# Altium schematic sheet DevKitWRM1470-r1.2.SchDoc
size A3; SheetNumber: 1; PageSetup: Record=PageOptions|CenterHorizontal=True|CenterVertical=True|PrintScale=0.52|XCorrection=1.00|YCorrection=1.00|PrintKind=1|BorderSize=5000000|LeftOffset=0|BottomOffset=0|Orientation=2|PaperLength=1000|PaperWidth=1000|Scale=100|PaperSource=7|PrintQuality=600|MediaType=1|DitherType=10|PaperKind=A4|PrintScaleMode=1
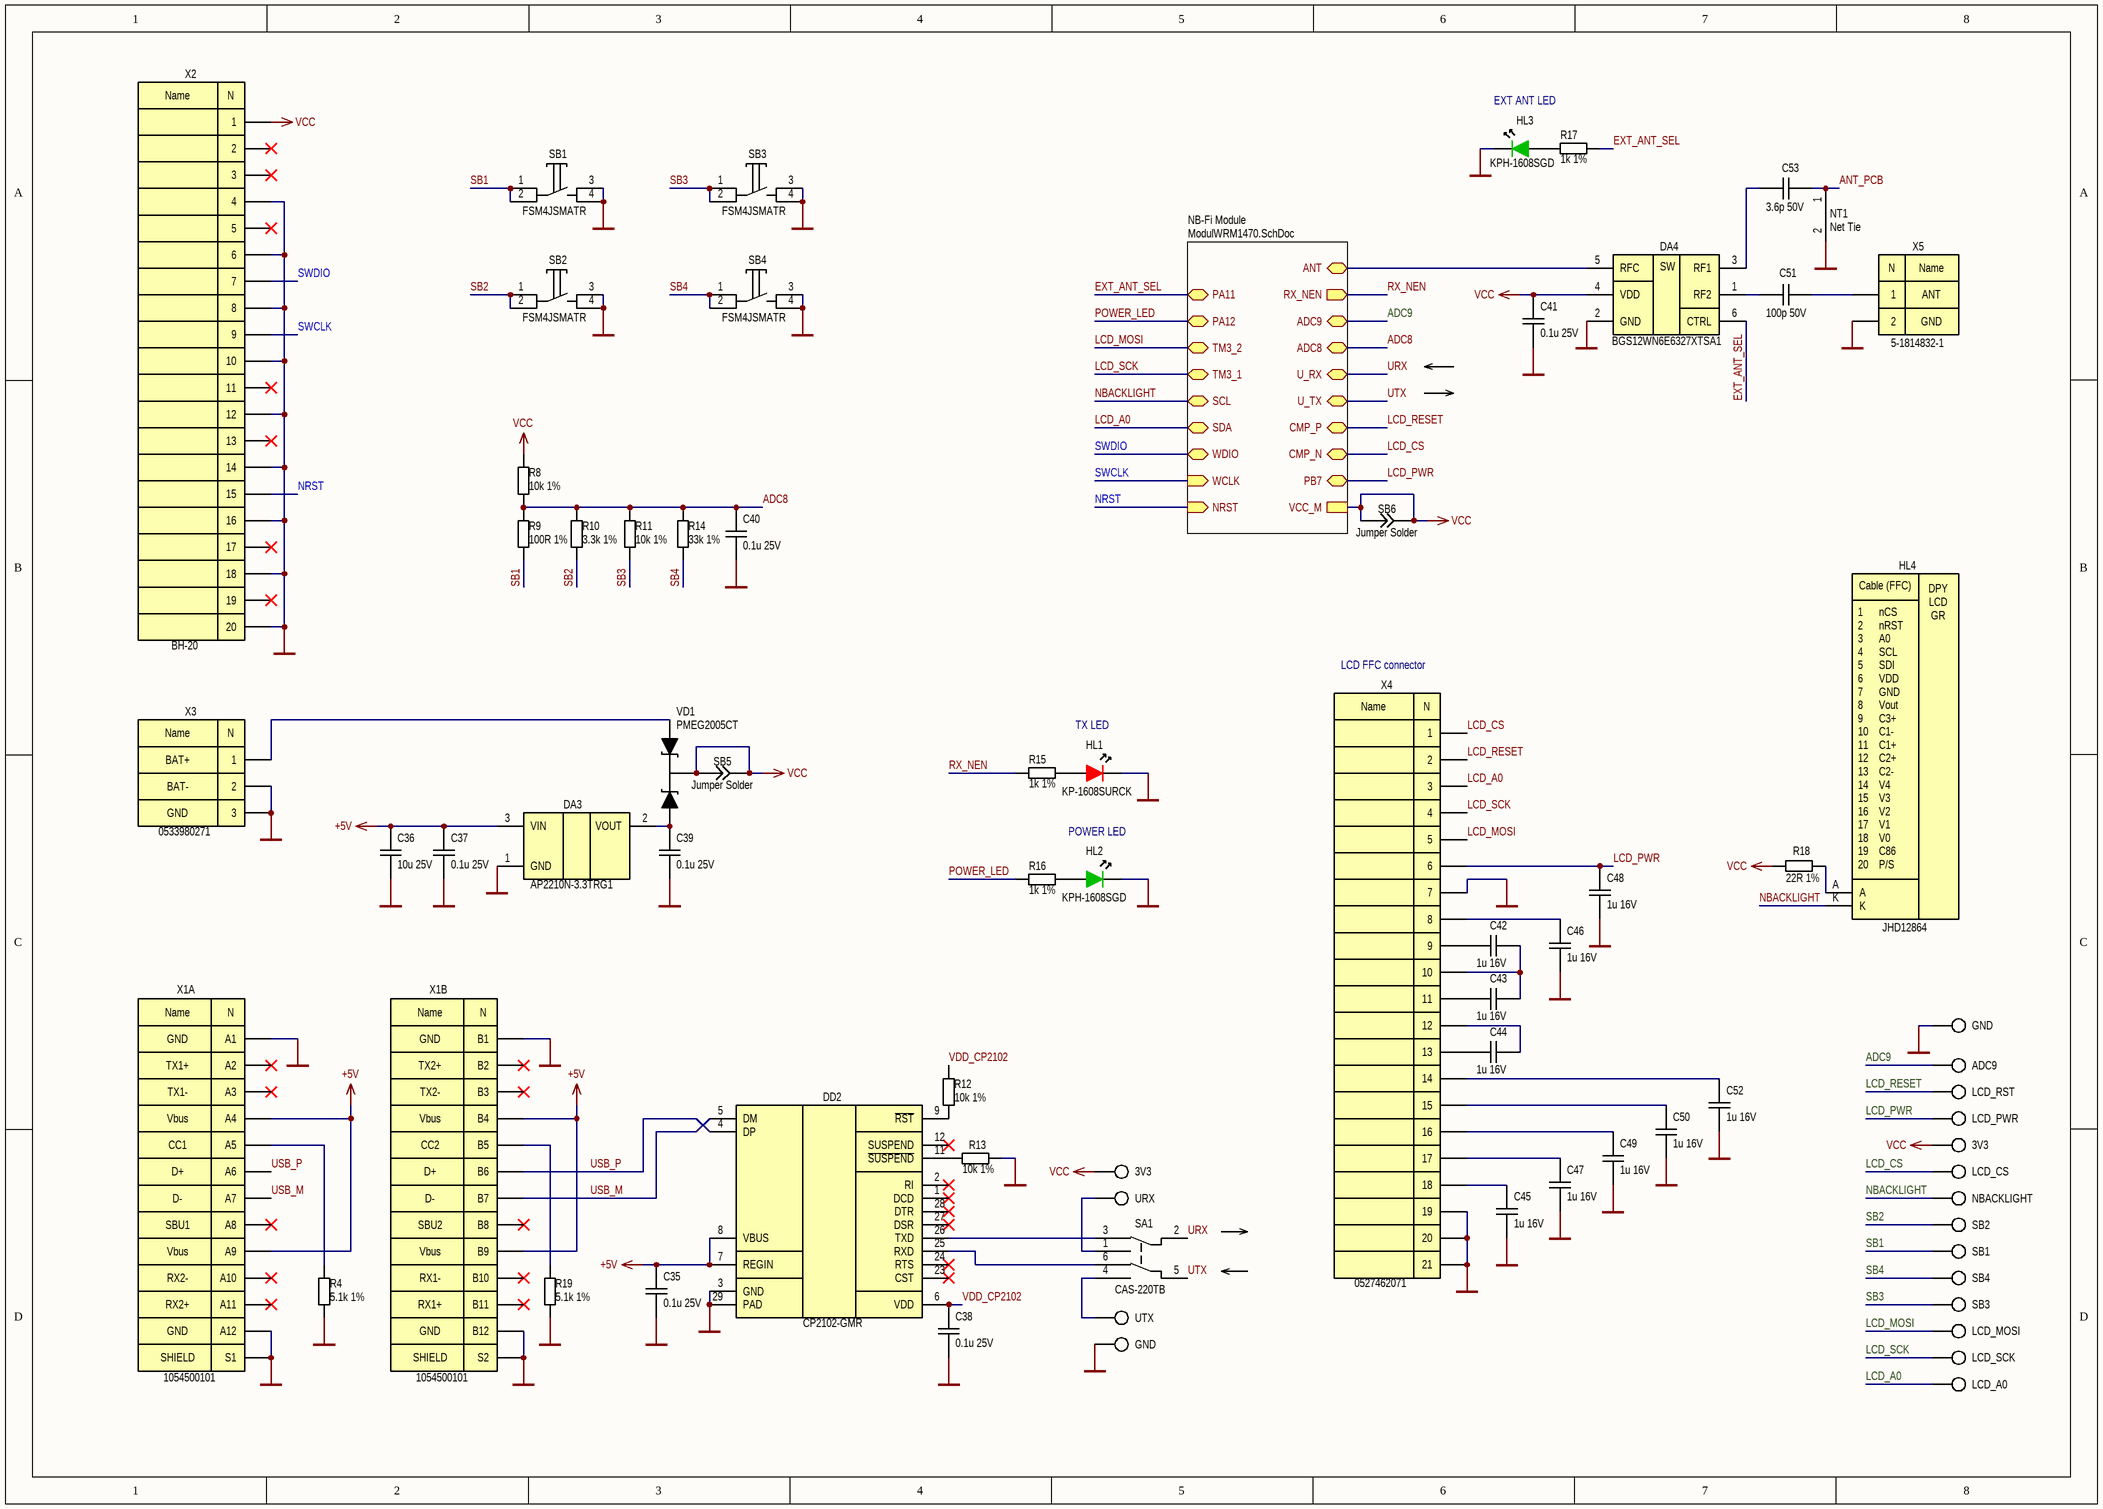
[diagram p0: DevKitWRM1470-r1.2.SchDoc]

## Parts
C35  0.1u 25V  [C0402]
C36  10u 25V  [C0805]
C37  0.1u 25V  [C0402]
C38  0.1u 25V  [C0402]
C39  0.1u 25V  [C0402]
C40  0.1u 25V  [C0402]
C41  0.1u 25V  [C0402]
C42  1u 16V  [C0402]
C43  1u 16V  [C0402]
C44  1u 16V  [C0402]
C45  1u 16V  [C0402]
C46  1u 16V  [C0402]
C47  1u 16V  [C0402]
C48  1u 16V  [C0402]
C49  1u 16V  [C0402]
C50  1u 16V  [C0402]
C51  100p 50V  [C0402]
C52  1u 16V  [C0402]
C53  3.6p 50V  [C0402]
DA3  AP2210N-3.3TRG1  [SOT23-3L]
DA4  BGS12WN6E6327XTSA1  [6-XFDFN]
DD2  CP2102-GMR  [QFN28]
HL1  KP-1608SURCK  [LED0603_RED]
HL2  KPH-1608SGD  [LED0603_GREEN]
HL3  KPH-1608SGD  [LED0603_GREEN]
HL4  JHD12864  [JHD12864]
NT1  Net Tie  [NETTIE-5.0x4.0]  (net tie, no BOM)
R4  5.1k 1%  [R0402]
R8  10k 1%  [R0402]
R9  100R 1%  [R0402]
R10  3.3k 1%  [R0402]
R11  10k 1%  [R0402]
R12  10k 1%  [R0402]
R13  10k 1%  [R0402]
R14  33k 1%  [R0402]
R15  1k 1%  [R0402]
R16  1k 1%  [R0402]
R17  1k 1%  [R0402]
R18  22R 1%  [R0402]
R19  5.1k 1%  [R0402]
SA1  CAS-220TB  [CAS-220]
SB1  FSM4JSMATR  [FSM4JSMATR]
SB2  FSM4JSMATR  [FSM4JSMATR]
SB3  FSM4JSMATR  [FSM4JSMATR]
SB4  FSM4JSMATR  [FSM4JSMATR]
SB5  Jumper Solder  [SB0805]  (no BOM)
SB6  Jumper Solder  [SB0805]  (no BOM)
VD1  PMEG2005CT  [SOT23-3L]
X1  1054500101  [1054500101]  (parts A,B of 2)
X2  BH-20  [BH-20_PCB]
X3  0533980271  [0533980271_PCB]
X4  0527462071  [0527462071_PCB]
X5  5-1814832-1  [5-1814832-1]
XT24  3V3  [PAD-d0.9-x1.5-y1.5]  (no BOM)
XT25  URX  [PAD-d0.9-x1.5-y1.5]  (no BOM)
XT26  UTX  [PAD-d0.9-x1.5-y1.5]  (no BOM)
XT27  GND  [PAD-d0.9-x1.5-y1.5]  (no BOM)
XT28  GND  [PAD-d0.9-x1.5-y1.5]  (no BOM)
XT29  ADC9  [PAD-d0.9-x1.5-y1.5]  (no BOM)
XT30  LCD_RST  [PAD-d0.9-x1.5-y1.5]  (no BOM)
XT31  LCD_PWR  [PAD-d0.9-x1.5-y1.5]  (no BOM)
XT32  3V3  [PAD-d0.9-x1.5-y1.5]  (no BOM)
XT33  LCD_CS  [PAD-d0.9-x1.5-y1.5]  (no BOM)
XT34  NBACKLIGHT  [PAD-d0.9-x1.5-y1.5]  (no BOM)
XT35  SB2  [PAD-d0.9-x1.5-y1.5]  (no BOM)
XT36  SB1  [PAD-d0.9-x1.5-y1.5]  (no BOM)
XT37  SB4  [PAD-d0.9-x1.5-y1.5]  (no BOM)
XT38  SB3  [PAD-d0.9-x1.5-y1.5]  (no BOM)
XT39  LCD_MOSI  [PAD-d0.9-x1.5-y1.5]  (no BOM)
XT40  LCD_SCK  [PAD-d0.9-x1.5-y1.5]  (no BOM)
XT41  LCD_A0  [PAD-d0.9-x1.5-y1.5]  (no BOM)

## Sub-sheets
NB-Fi Module = ModulWRM1470.SchDoc: ADC8 (bidir), TM3_2 (bidir), ADC9 (bidir), TM3_1 (bidir), SCL (bidir), SDA (bidir), WDIO (bidir), WCLK (in), NRST (in), U_RX (bidir), U_TX (bidir), CMP_P (bidir), CMP_N (bidir), ANT (bidir), PA12 (bidir), PB7 (bidir), VCC_M, PA11 (bidir), RX_NEN (out)

## Nets
+5V: C35.2 C36.1 C37.2 DA3.3(VIN) DD2.7(REGIN) DD2.8(VBUS) X1.A4 X1.A9 X1.B4 X1.B9
GND: C35.1 C36.2 C37.1 C38.1 C39.1 C40.1 C41.1 C45.1 C46.1 C47.1 C48.1 C49.1 C50.1 C52.1 DA3.1(GND) DA4.2(GND) DD2.3(GND) DD2.29(PAD) HL1.2 HL2.2 HL3.2 NT1.2 R4.2 R13.1 R19.2 SB1.3 SB1.4 SB2.3 SB2.4 SB3.3 SB3.4 SB4.3 SB4.4 X1.A1 X1.A12 X1.B1 X1.B12 X1.S1 X1.S2 X2.4 X2.6 X2.8 X2.10 X2.12 X2.14 X2.16 X2.18 X2.20 X3.2 X3.3 X4.7 X4.19 X4.20 X4.21 X5.2 XT27.1 XT28.1
VCC: C41.2 DA4.4(VDD) R8.2 R18.2 SB5.1 SB5.2 SB6.1 SB6.2 VD1.3(K) X2.1 XT24.1 XT32.1 ; sheet NB-Fi Module/VCC_M
ADC8: C40.2 R8.1 R9.2 R10.2 R11.2 R14.2 ; sheet NB-Fi Module/ADC8
ADC9: XT29.1 ; sheet NB-Fi Module/ADC9
ANT_PCB: C53.2 NT1.1
EXT_ANT_SEL: DA4.6(CTRL) R17.1 ; sheet NB-Fi Module/PA11
LCD_A0: X4.3 XT41.1 ; sheet NB-Fi Module/SDA
LCD_CS: X4.1 XT33.1 ; sheet NB-Fi Module/CMP_N
LCD_MOSI: X4.5 XT39.1 ; sheet NB-Fi Module/TM3_2
LCD_PWR: C48.2 X4.6 XT31.1 ; sheet NB-Fi Module/PB7
LCD_RESET: X4.2 XT30.1 ; sheet NB-Fi Module/CMP_P
LCD_SCK: X4.4 XT40.1 ; sheet NB-Fi Module/TM3_1
NBACKLIGHT: HL4.K XT34.1 ; sheet NB-Fi Module/SCL
NRST: X2.15 ; sheet NB-Fi Module/NRST
POWER_LED: R16.1 ; sheet NB-Fi Module/PA12
RX_NEN: R15.1 ; sheet NB-Fi Module/RX_NEN
SB1: R9.1 SB1.1 SB1.2 XT36.1
SB2: R10.1 SB2.1 SB2.2 XT35.1
SB3: R11.1 SB3.1 SB3.2 XT38.1
SB4: R14.1 SB4.1 SB4.2 XT37.1
SWCLK: X2.9 ; sheet NB-Fi Module/WCLK
SWDIO: X2.7 ; sheet NB-Fi Module/WDIO
URX: SA1.2 ; sheet NB-Fi Module/U_RX
USB_M: DD2.5(DM) X1.A7 X1.B7
USB_P: DD2.4(DP) X1.A6 X1.B6
UTX: SA1.5 ; sheet NB-Fi Module/U_TX
VDD_CP2102: C38.2 DD2.6(VDD) R12.2
NetC39_2: C39.2 DA3.2(VOUT) VD1.2(A2)
NetC42_1: C42.1 C43.1 X4.10
NetC42_2: C42.2 X4.9
NetC43_2: C43.2 X4.11
NetC44_1: C44.1 X4.12
NetC44_2: C44.2 X4.13
NetC45_2: C45.2 X4.18
NetC46_2: C46.2 X4.8
NetC47_2: C47.2 X4.17
NetC49_2: C49.2 X4.16
NetC50_2: C50.2 X4.15
NetC51_1: C51.1 DA4.1(RF2)
NetC51_2: C51.2 X5.1
NetC52_2: C52.2 X4.14
NetC53_1: C53.1 DA4.3(RF1)
NetDA4_5: DA4.5(RFC) ; sheet NB-Fi Module/ANT
NetDD2_9: DD2.9(~{RST}) R12.1
NetDD2_11: DD2.11(~{SUSPEND}) R13.2
NetDD2_25: DD2.25(RXD) SA1.6
NetDD2_26: DD2.26(TXD) SA1.3
NetHL1_1: HL1.1 R15.2
NetHL2_1: HL2.1 R16.2
NetHL3_1: HL3.1 R17.2
NetHL4_A: HL4.A R18.1
NetR4_1: R4.1 X1.A5
NetR19_1: R19.1 X1.B5
NetSA1_1: SA1.1 XT25.1
NetSA1_4: SA1.4 XT26.1
NetVD1_1: VD1.1(A1) X3.1

Not connected (* = marked no-connect by the designer): DD2 1(DCD)* 2(RI)* 12(SUSPEND)* 23(CST)* 24(RTS)* 27(DSR)* 28(DTR)*; X1 A2* A3* A8* A10* A11* B2* B3* B8* B10* B11*; X2 2* 3* 5* 11* 13* 17* 19*

## Notes on the sheet
- EXT ANT LED
- LCD FFC connector
- BAT+
- BAT-
- TX LED
- GND
- POWER LED
- (in symbol 5-1814832-1) N; Name; ANT; GND
- (in symbol 0527462071) Name; N
- (in symbol 0533980271) Name; N
- (in symbol 1054500101, part A) Name; N; GND; TX1+; TX1-; Vbus; CC1; D+; D-; SBU1; RX2-; RX2+; SHIELD
- (in symbol 1054500101, part B) Name; N; GND; TX2+; TX2-; Vbus; CC2; D+; D-; SBU2; RX1-; RX1+; SHIELD
- (in symbol BGS12WN6E6327XTSA1) SW
- (in symbol BH-20) Name; N
- (in symbol JHD12864) Cable (FFC); 1; nCS; DPY / LCD / GR; 2; nRST; 3; A0; 4; SCL; 5; SDI; 6; VDD; 7; GND; 8; Vout; 9; C3+; 10; C1-; 11; C1+; 12; C2+; 13; C2-; 14; V4; 15; V3; 16; V2; 17; V1; 18; V0; 19; C86; 20; P/S

## Library data of the parts
C35 C37-C41 = CC0402KRX7R8BB104: CAP CER 0.1UF 25V X7R 0402; PartNumber: CC0402KRX7R8BB104
C36 = CL21A106KAFN3NE: CAP CER 10UF 25V X5R 0805; PartNumber: CL21A106KAFN3NE
C42-C50 C52 = CC0402KRX5R7BB105: CAP CER 1UF 16V X5R 0402; PartNumber: CC0402KRX5R7BB105
C51 = CC0402JRNPO9BN101: CAP CER 100PF 50V C0G/NPO 0402; PartNumber: CC0402JRNPO9BN101
C53 = CC0402BRNPO9BN3R6: CAP CER 3.6PF 50V NPO 0402; PartNumber: CC0402BRNPO9BN3R6
DA3 = AP2210N-3.3TRG1: IC REG LINEAR 3.3V 300MA SOT23-3; PartNumber: AP2210N-3.3TRG1
DA4 = BGS12WN6E6327XTSA1: RF Switch IC WLAN SPDT 50Ohm PG-TSNP-6-10; PartNumber: BGS12WN6E6327XTSA1
DD2 = CP2102-GMR: IC USB-TO-UART BRIDGE 28VQFN; PartNumber: CP2102-GMR
HL1 = KP-1608SURCK: LED Red 0603 1.95V Forward voltage typ.; PartNumber: KP-1608SURCK
HL2 HL3 = KPH-1608SGD: Led Green 0603 2.2V Forward voltage typ.; PartNumber: KPH-1608SGD
HL4 = JHD12864: Display Graphical with LED-backlight; PartNumber: JHD12864
NT1 = NT-1: PCB Net Tie
R4 R19 = RC0402FR-075K1L: RES SMD 5.1K OHM 1% 1/16W 0402; PartNumber: RC0402FR-075K1L
R8 R11-R13 = RC0402FR-0710KL: RES SMD 10K OHM 1% 1/16W 0402; PartNumber: RC0402FR-0710KL
R9 = RC0402FR-07100RL: RES SMD 100 OHM 1% 1/16W 0402; PartNumber: RC0402FR-07100RL
R10 = RC0402FR-073K3L: RES SMD 3.3K OHM 1% 1/16W 0402; PartNumber: RC0402FR-073K3L
R14 = RC0402FR-0733KL: RES SMD 33K OHM 1% 1/16W 0402; PartNumber: RC0402FR-0733KL
R15-R17 = RC0402FR-071KL: RES SMD 1K OHM 1% 1/16W 0402; PartNumber: RC0402FR-071KL
R18 = RC0402FR-0722RL: RES SMD 22 OHM 1% 1/16W 0402; PartNumber: RC0402FR-0722RL
SA1 = CAS-220TB: SWITCH SLIDE DPDT 100MA 6V; PartNumber: CAS-220TB
SB1-SB4 = FSM4JSMATR: SWITCH TACTILE SPST-NO 0.05A 24V; PartNumber: FSM4JSMATR
SB5 SB6 = JS_0805: Jumper Solder 0805; Value: *
VD1 = PMEG2005CT: DIODE ARRAY SCHOTTKY 20V SOT23; PartNumber: PMEG2005CT
X1 = 1054500101: CONN RCP USB3.1 TYPEC 24P SMD RA; PartNumber: 1054500101; ComponentLink1Description: Datasheet; ComponentLink1URL: https://www.molex.com/pdm_docs/ps/PS-105448-001.pdf; ComponentLink2Description: Drawing; ComponentLink2URL: https://www.molex.com/pdm_docs/sd/1054500101_sd.pdf
X2 = BH-20: CONN MALE 20POS 2.54 (IDC-20MS); PartNumber: BH-20
X3 = 0533980271: CONN HEADER SMD 2POS 1.25MM; PartNumber: 0533980271
X4 = 0527462071: CONN FFC BOTTOM 20POS 0.50MM R/A; PartNumber: 0527462071
X5 = 5-1814832-1: CONN SMA JACK STR 50 OHM PCB; PartNumber: 5-1814832-1
XT24-XT41 = PIN